# Altium schematic sheet SchematicTemplate.SchDoc
size A4; SheetNumber: 1; SheetTotal: 1
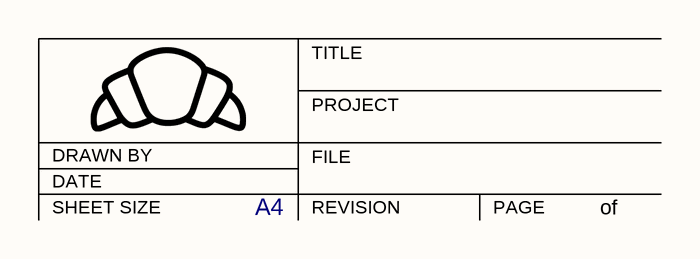
[diagram p0: SchematicTemplate.SchDoc]

## Notes on the sheet
- TITLE
- DRAWN BY
- DATE
- PROJECT
- FILE
- SHEET SIZE
- A4
- REVISION
- PAGE
- of